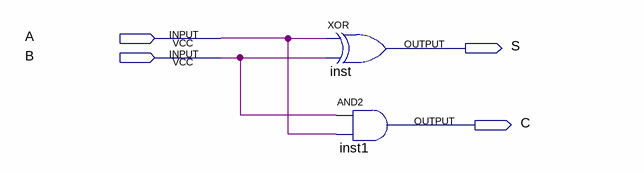
[diagram p0: schematic sheet]
// Quartus schematic HalfAdd.bdf as structural Verilog: 2 symbols, 4 pins
module HalfAdd (
  input  A,
  input  B,
  output S,
  output C
);

  xor inst (S, A, B);
  and inst1 (C, B, A);
endmodule
